# Altium schematic sheet Sheet1.SchDoc
size A3; SheetNumber: 3; SheetTotal: 3
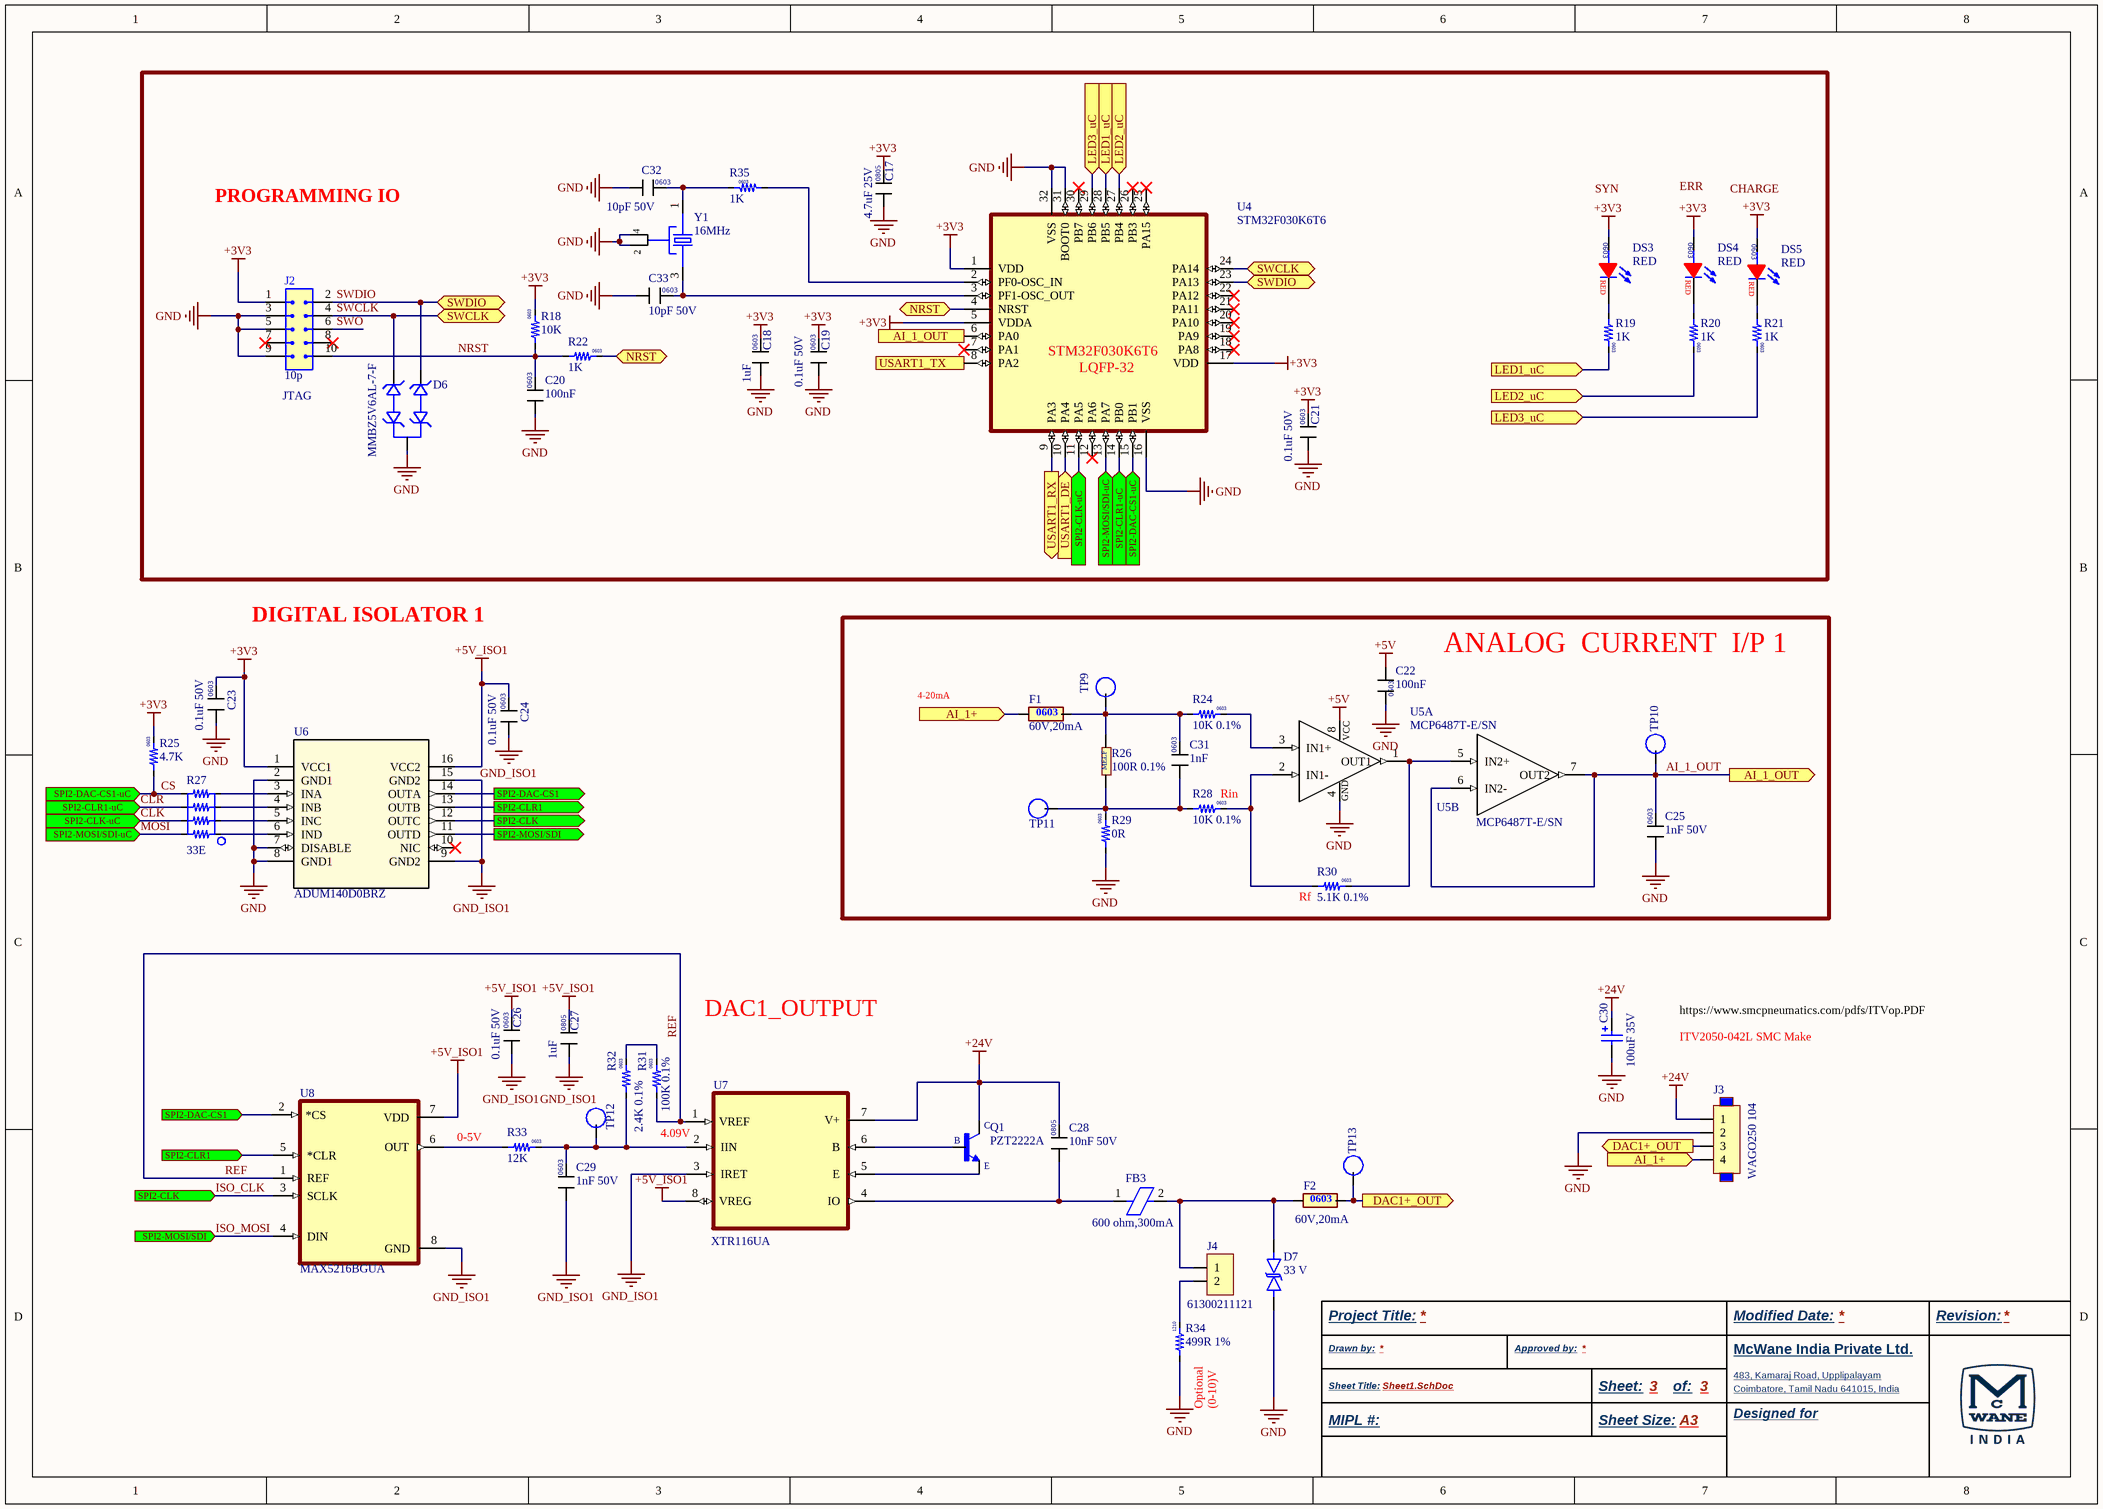
[diagram p0: Sheet1.SchDoc]

## Parts
C17  4.7uF 25V  [CAP_0805]
C18  1uF  [CAP_0603]
C19  0.1uF 50V  [CAP_0603]
C20  100nF  [CAP_0603]
C21  0.1uF 50V  [CAP_0603]
C22  100nF  [CAP_0603]
C23  0.1uF 50V  [CAP_0603]
C24  0.1uF 50V  [CAP_0603]
C25  1nF 50V  [CAP_0603]
C26  0.1uF 50V  [CAP_0603]
C27  1uF  [CAP_0805]
C28  10nF 50V  [CAP_0805]
C29  1nF 50V  [CAP_0603]
C30  100uF 35V  [CAP_ELE_AL_6.3X7.7]
C31  1nF  [CAP_0603]
C32  10pF 50V  [CAP_0603]
C33  10pF 50V  [CAP_0603]
D6  MMBZ5V6AL-7-F  [SOT23]
D7  33 V  [Diode_SMA_DO-214AC]
DS3  RED  [LED_0603]
DS4  RED  [LED_0603]
DS5  RED  [LED_0603]
F1  60V,20mA  [FUSE_0603]
F2  60V,20mA  [FUSE_0603]
FB3  600 ohm,300mA  [Ferrite_bead_0603]
J2  10p  [FTS-105-01-F-DV]
J3  WAGO250 104  [WAGO250_104]
J4  61300211121  [BERG_2_PIN_M_V_S_2.54mm]
Q1  PZT2222A  [SOT-223]
R18  10K  [RES_0603]
R19  1K  [RES_0603]
R20  1K  [RES_0603]
R21  1K  [RES_0603]
R22  1K  [RES_0603]
R24  10K 0.1%  [RES_0603]
R25  4.7K  [RES_0603]
R26  100R 0.1%  [RES_MELF]
R27  33E  [1206_8pin_Array_Resistor]
R28  10K 0.1%  [RES_0603]
R29  0R  [RES_0603]
R30  5.1K 0.1%  [RES_0603]
R31  100K 0.1%  [RES_0603]
R32  2.4K 0.1%  [RES_0603]
R33  12K  [RES_0603]
R34  499R 1%  [RES_1210]
R35  1K  [RES_0603]
TP9  TEST_POINT_SMD  [TEST_POINT_SMD]  (value not drawn)
TP10  TEST_POINT_SMD  [TEST_POINT_SMD]  (value not drawn)
TP11  TEST_POINT_SMD  [TEST_POINT_SMD]  (value not drawn)
TP12  TEST_POINT_SMD  [TEST_POINT_SMD]  (value not drawn)
TP13  TEST_POINT_SMD  [TEST_POINT_SMD]  (value not drawn)
U4  STM32F030K6T6  [LQFP32]
U5  MCP6487T-E/SN  [SOIC127P600X175-8N]  (parts A,B of 2)
U6  ADUM140D0BRZ  [SOIC127P600X175-16N]
U7  XTR116UA  [SOIC-8N]
U8  MAX5216BGUA  [SOP8P65_300X640X120L60X24N(TSSOP8)]
Y1  16MHz  [XTAL_3.2X2.5mm]

## Blocks framed on the sheet
PROGRAMMING IO: C17-C21 C32 C33 D6 DS3-DS5 J2 R18-R22 R35 U4 Y1
ANALOG  CURRENT  I/P 1: C22 C25 C31 F1 R24 R26 R28-R30 TP9-TP11 U5

## Ports
AI_1+ (in), AI_1_OUT (out), DAC1+_OUT (out), LED1_uC (in), LED2_uC (in), LED3_uC (in), NRST (bidir), SPI2-CLK (in), SPI2-CLK (out), SPI2-CLK-uC (in), SPI2-CLR1 (in), SPI2-CLR1 (out), SPI2-CLR1-uC (in), SPI2-DAC-CS1 (in), SPI2-DAC-CS1 (out), SPI2-DAC-CS1-uC (in), SPI2-MOSI/SDI (in), SPI2-MOSI/SDI (out), SPI2-MOSI/SDI-uC (in), SWCLK (bidir), SWDIO (bidir), USART1_DE (in), USART1_RX (out), USART1_TX (in)

## Nets
+3V3: C17.2 C18.2 C19.2 C21.2 C23.2 DS3.A DS4.A DS5.A J2.1 R18.2 R25.2 U4.1(VDD) U4.5(VDDA) U4.17(VDD) U6.1(VCC1)
+5V: C22.2 U5.8(VCC)
+5V_ISO1: C24.2 C26.2 C27.2 U6.16(VCC2) U7.8(VREG) U8.7(VDD)
+24V: C28.2 C30.2(P) J3.1 Q1.2(C) U7.7(V+)
GND: C17.1 C18.1 C19.1 C20.1 C21.1 C22.1 C23.1 C25.1 C30.1(N) C32.1 C33.1 D6.3(GND) D7.A J2.3 J2.5 J2.9 J3.2 R29.1 R34.1 U4.16(VSS) U4.31(BOOT0) U4.32(VSS) U5.4(GND) U6.2(GND1) U6.7(DISABLE) U6.8(GND1) Y1.2(GND) Y1.4(GND)
GND_ISO1: C24.1 C26.1 C27.1 C29.1 U6.9(GND2) U6.15(GND2) U7.3(IRET) U8.8(GND)
AI_1+: F1.1 J3.4 ; port AI_1+
AI_1_OUT: C25.2 TP10.1 U4.6(PA0) U5.6(IN2-) U5.7(OUT2) ; port AI_1_OUT
CLK: R27.7 U4.11(PA5) ; port SPI2-CLK-uC
CLR: R27.6 U4.14(PB0) ; port SPI2-CLR1-uC
CS: R25.1 R27.5 U4.15(PB1) ; port SPI2-DAC-CS1-uC
DAC1+_OUT: F2.2 J3.3 TP13.1 ; port DAC1+_OUT
ISO_CLK: U6.12(OUTC) U8.3(SCLK) ; port SPI2-CLK
ISO_MOSI: U6.11(OUTD) U8.4(DIN) ; port SPI2-MOSI/SDI
LED1_uC: R19.2 U4.28(PB5) ; port LED1_uC
LED2_uC: R20.2 U4.27(PB4) ; port LED2_uC
LED3_uC: R21.2 U4.29(PB6) ; port LED3_uC
MOSI: R27.8 U4.13(PA7) ; port SPI2-MOSI/SDI-uC
NRST: C20.2 J2.10 R18.1 R22.1
NRST: R22.2 U4.4(NRST) ; port NRST  [a separate net that carries the same name]
REF: R31.1 U7.1(VREF) U8.1(REF)
SPI2-CLR1: U6.13(OUTB) U8.5(*CLR) ; port SPI2-CLR1
SPI2-DAC-CS1: U6.14(OUTA) U8.2(*CS) ; port SPI2-DAC-CS1
SWCLK: D6.1(IO1) J2.4 U4.24(PA14) ; port SWCLK
SWDIO: D6.2(IO2) J2.2 U4.23(PA13) ; port SWDIO
SWO: J2.6
USART1_DE: U4.10(PA4) ; port USART1_DE
USART1_RX: U4.9(PA3) ; port USART1_RX
USART1_TX: U4.8(PA2) ; port USART1_TX
NetC28_1: C28.1 FB3.1 U7.4(IO)
NetC29_2: C29.2 R32.1 R33.2 TP12.1 U7.2(IIN)
NetC31_1: C31.1 R26.1 R28.1 R29.2 TP11.1
NetC31_2: C31.2 F1.2 R24.1 R26.2 TP9.1
NetC32_2: C32.2 R35.2 Y1.1
NetC33_2: C33.2 U4.3(PF1-OSC_OUT) Y1.3
NetD7_C: D7.C F2.1 FB3.2 J4.1
NetDS3_C: DS3.C R19.1
NetDS4_C: DS4.C R20.1
NetDS5_C: DS5.C R21.1
NetJ4_2: J4.2 R34.2
NetQ1_1: Q1.1(B) U7.6(B)
NetQ1_3: Q1.3(E) U7.5(E)
NetR24_2: R24.2 U5.3(IN1+)
NetR27_1: R27.1 U6.6(IND)
NetR27_2: R27.2 U6.5(INC)
NetR27_3: R27.3 U6.4(INB)
NetR27_4: R27.4 U6.3(INA)
NetR28_2: R28.2 R30.1 U5.2(IN1-)
NetR30_2: R30.2 U5.1(OUT1) U5.5(IN2+)
NetR31_2: R31.2 R32.2
NetR33_1: R33.1 U8.6(OUT)
NetR35_1: R35.1 U4.2(PF0-OSC_IN)

Not connected (* = marked no-connect by the designer): J2 7* 8*; U4 7(PA1)* 12(PA6)* 18(PA8)* 19(PA9)* 20(PA10)* 21(PA11)* 22(PA12)* 25(PA15)* 26(PB3)* 30(PB7)*; U6 10(NIC)*

## Notes on the sheet
- (near J2) JTAG
- DIGITAL ISOLATOR 1
- 4-20mA
- (near R28) Rin
- (near R30) Rf
- DAC1_OUTPUT
- ITV2050-042L SMC Make
- https://www.smcpneumatics.com/pdfs/ITVop.PDF
- 0-5V
- 4.09V
- (near R34) Optional
- (near R34) (0-10)V
- Labels drawn without touching a wire or pin: CHARGE, ERR, SYN
- Project Title:
- Modified Date:
- Revision:
- Drawn by:
- Sheet Title:
- Approved by:
- Sheet:
- of:
- McWane India Private Ltd.
- 483, Kamaraj Road, Upplipalayam
- Coimbatore, Tamil Nadu 641015, India
- MIPL #:
- Sheet Size:
- A3
- Designed for

## Library data of the parts
C17 = C0805-4.7uF 25V-MLCC: SMD Multilayer Ceramic Capacitor, 4.7 µF, 25 V, 0805 [2012 Metric], ± 10%, X7R, -55 °C; Manufacturer Part Number: CC0805KKX7R8BB475; Brand: YAGEO; Marking: 475; Suppplier: ELEMENT 14; Package: 0805; Component: Capacitor
C18 = C0603-1uF 50V-MLCC: SMD Multilayer Ceramic 1 µF ±10% 50V Ceramic Capacitor X7R 0603 (2012 Metric); Manufacturer Part Number: CC0603KRX7R9BB105; Brand: YAGEO; Marking: 105; Package: 0603; Supplier: ELEMENT 14; Component: Capacitor; LCSC Part: C559769
C19-C24 C26 = C0603-0.1uF 50V-MLCC: SMD Multilayer Ceramic Capacitor, 0.1 µF, 50 V, 0603 [1608 Metric], ± 10%, X7R; Manufacturer Part Number: CC0603KRX7R9BB104; Brand: YAGEO; Marking: 104; Package: 0603; Supplier: ELEMENT 14; Component: Capacitor
  C20 C22: LCSC Part: C14663
  C26: Supplier PN: C314282
C25 = C0603-1nF 50V-MLCC: SMD Multilayer Ceramic Capacitor, 1 nF, 50 V, 0603 [1608 Metric], ± 10%, X7R; Manufacturer Part Number: CC0603KRX7R9BB102; Brand: YAGEO; Marking: ELEMENT 14; Suplier PN: C100040; Package: 0603; Supplier: 102; Component: Capacitor
C27 = C0805-1uF 50V-MLCC: SMD Multilayer Ceramic Capacitor, 1 µF, 50 V, 0805 [2012 Metric], ± 10%, X7R, -55 °C; Manufacturer Part Number: CC0805KKX7R9BB105; Brand: YAGEO; Marking: 105; Package: 0805; Component: Capacitor; LCSC Part: C91185
C28 = C0805-10nF 50V-MLCC: SMD Multilayer Ceramic Capacitor, 10nF, 50 V, 0805 [2012 Metric], ± 10%, X7R; Manufacturer Part Number: CC0805KRX7R9BB103; Brand: YAGEO; Marking: 103; Package: 0805; Supplier: ELEMENT 14; Component: Capacitor
C29 C31 = C0603-1nF 50V-MLCC: SMD Multilayer Ceramic Capacitor, 1 nF, 50 V, 0603 [1608 Metric], ± 10%, X7R; Manufacturer Part Number: CC0603KRX7R9BB102; Brand: YAGEO; Marking: ELEMENT 14; Package: 0603; Supplier: 102; Component: Capacitor
C30 = CAP_SMD_100uF_35V: SMD Aluminium Electrolytic Capacitor, Radial Can - SMD, 100 µF, 35 V, 2000 hours @ 105°C, Polar; Manufacturer Part Number: MCVVT035M101EA6L; Brand: MULTICOMP PRO; Package: 6.3X7.7mm; Marking: *; Supplier: Element 14; Component: Capacitor
C32 C33 = C0603-10pF 50V-MLCC: SMD Multilayer Ceramic Capacitor, 10 pF, 50 V, 0603 [1608 Metric], ± 10%, C0G / NP0, -55 °C; Manufacturer Part Number: CC0603KRNPO9BN100; Brand: YAGEO; Marking: 100; Package: 0603; Supplier: ELEMENT 14; Component: Capacitor
D6 = MMBZ5V6AL-7-F: ESD Suppressors / TVS Diodes 5.6V 225mW; Brand: Diodes Incorporated; Package: SOT-23-3; Manufacturer Part Number: MMBZ5V6AL-7-F; Marking: *; LCSC Part: C531167
D7 = SMAJ33CAHE3_A/H_1: TVS Diode, TRANSZORB SMAJ, Bidirectional, 33 V, 53.3 V, DO-214AC (SMA), 2 Pins; Brand: Vishay General Semiconductor; Package: DO-214AC-2; Manufacturer Part Number: SMAJ33CAHE3_A/H; Supplier: *; Marking: *
DS3-DS5 = 19-217/R6C-AL1M2VY/3T: Red LED Indication - Discrete 1.95V 0603 (1608 Metric); Brand: Everlight Elec; Package: 0603; Manufacturer Part Number: 19-217/R6C-AL1M2VY/3T; LCSC Part: C72044
F1 F2 = 0ZCM0002FF2G: Polymeric PTC Resettable Fuse 60V 20 mA Ih Surface Mount 0603 (1608 Metric); Brand: Bel Fuse; Manufacturer Part Number: 0ZCM0002FF2G; Package: 0603
FB3 = Ferrite_0603: Ferrite Beads 600ohms 100MHz 300mA Monolithic 0603 SMD; Manufacturer Part Number: HZ0603C601R-10; Brand: Laird; Supplier: Mouser Electronics; Marking: *; Package: 0603
J2 = FTS-105-01-F-DV: Connector Header Surface Mount 10 position 0.050" (1.27mm); Brand: Samtec Inc.; Value: 5X2 POS, 1.27mmP; Manufacturer Part Number: FTS-105-01-F-DV; Datasheet Web: http://suddendocs.samtec.com/catalog_english/fts.pdf; Datasheet Local: *; DNP: *; MIPL Status: *; MIPL Id: *; Operating Temperature: -55°C ~ 125°C; Package: SMD; Type: Header - Male; Voltage rating: *; LCSC Part: C3348793
J3 = WAGO250_104: 4 Position Wire to Board Terminal Block 45° (135°) Angle with Board 0.138" (3.50mm) Through Hole; Manufacturer Part Number: 250-104/000-012; Brand: WAGO Corporation; Marking: *; Supplier: *; Package: 3.5mm
J4 = BERG_2_PIN_M_V_S_2.54mm: Pin Header, Vertical, Board-to-Board, 2.54 mm, 1 Rows, 2 Contacts, Through Hole Straight, WR-PHD; Brand: Würth Elektronik; Manufacturer Part Number: 61300211121; Package: 2.54mm
Q1 = PZT2222A: Bipolar _BJT_ Transistor NPN 40V 1A 300MHz 1W Surface Mount; Brand: ON Semiconductor; Manufacturer Part Number: PZT2222A; Package: SOT-223-4; SnapEDA_Link: https://www.snapeda.com/parts/PZT2222A/ON%20Semiconductor/view-part/1171857/?ref=snap; Availability: Unavailable; Price: None; Value: *
R18 = R0603-10K-1%: SMD Chip Resistor, 10 kohm, ± 1%, 100 mW, 0603 [1608 Metric], Thick Film, General Purpose; Manufacturer Part Number: RC0603FR-0710KL; Brand: YAGEO; Marking: 1002; Package: 0603; Supplier: ELEMENT 14; Component: Resistor; LCSC Part: C98220
R19-R22 R35 = R0603-1K-1%: SMD Chip Resistor, 1 kohm, ± 1%, 100 mW, 0603 [1608 Metric], Thick Film, General Purpose; Manufacturer Part Number: RC0603FR-071KL; Brand: YAGEO; Marking: 1001; Package: 0603; Supplier: ELEMENT 14; Component: Resistor; LCSC Part: C109318
R24 R28 = R0603-10K-0.1%: SMD Chip Resistor, 10 kohm, ± 0.1%, 100 mW, 0603 [1608 Metric], Thick Film, General Purpose; Manufacturer Part Number: RT0603BRD0710KL; Brand: YAGEO; Marking: 1002; Package: 0603; Component: Resistor; Supplier: ELEMENT 14; LCSC Part: C95204
R25 = R0603-4.7K-1%: SMD Chip Resistor, 4.7 kohm, ± 1%, 100 mW, 0603 [1608 Metric], Thick Film, General Purpose; Manufacturer Part Number: RC0603FR-074K7L.; Brand: YAGEO; Marking: 4701; Supplier: ELEMENT 14; Package: 0603; Component: Resistor
R26 = MCFRBTNV1000: Surface Mount MELF Resistor, 100 ohm, MCF, 200 V, Metal Film, 250 mW, ± 0.1%; Brand: MULTICOMP PRO; Manufacturer Part Number: MCFRBTNV1000; Package: MELF; Component: Resistor
R27 = R1206-33E-1%-ARRAY: 4 8 ±5% 33Ω 62.5mW ±200ppm/℃ 0603x4 Resistor Networks & Arrays ROHS; Manufacturer Part Number: YC164-JR-0733RL; Brand: YAGEO; Package: 0603x4; Component: Resistor; LCSC Part: C165956
R29 = R0603-0E-1%: 0 Ohms Jumper 0.1W, 1/10W Chip Resistor 0603 (1608 Metric) Moisture Resistant Thick Film; Manufacturer Part Number: RC0603JR-070RL; Brand: YAGEO; Marking: 000; Package: 0603; Supplier: ELEMENT 14; Component: Resistor
R30 = R0603-5.1K-0.1%: SMD Chip Resistor, 5.1 kohm, ± 0.1%, 100 mW, 0603 [1608 Metric], Thick Film, General Purpose; Manufacturer Part Number: RT0603BRD075K1L; Brand: YAGEO; Marking: 5101; Supplier: ELEMENT 14; Package: 0603; Component: Resistor; LCSC Part: C122969
R31 = R0603-100K-0.1%: SMD Chip Resistor, 100 kohm, ± 0.1%, 100 mW, 0603 [1608 Metric], Thick Film, General Purpose; Manufacturer Part Number: RT0603BRD07100KL; Brand: YAGEO; Marking: 1003; Package: 0603; Supplier: ELEMENT 14; Component: Resistor; LCSC Part: C122538
R32 = R0603-2K4-0.1%: SMD Chip Resistor, 2.4 kohm, ± 0.1%, 100 mW, 0603 [1608 Metric], Thick Film, General Purpose; Manufacturer Part Number: RT0603BRD072K4L; Brand: YAGEO; Package: 0603; Supplier: ELEMENT 14; Component: Resistor; LCSC Part: C861300
R33 = R0603-12K-1%: SMD Chip Resistor, 12 kohm, ± 1%, 100 mW, 0603 [1608 Metric], Thick Film, General Purpose; Manufacturer Part Number: RC0603FR-0712KL; Brand: YAGEO; Marking: 1202; Supplier: ELEMENT 14; Package: 0603; Component: Resistor; LCSC Part: C114659
R34 = R1210-499R-1%: 0.5W Thick Film Resistors ±100ppm/℃ ±1% 499Ω 1210 Chip Resistor - Surface Mount ROHS; Manufacturer Part Number: RC1210FR-07499RL; Brand: YAGEO; Package: 1210; Component: Resistor; LCSC Part: RC1210FR-07499RL; Supplier: ELEMENT 14
U4 = STM32F030K6T6: ARM® Cortex®-M0 STM32F0 Microcontroller IC 32-Bit Single-Core 48MHz 32KB (32K x 8) FLASH 32-LQFP (7x7); Brand: STMICROELECTRONICS; Manufacturer Part Number: STM32F030K6T6; Package: LQFP-32
U5 = MCP6487T-E/SN: General Purpose Amplifier 2 Circuit Rail-to-Rail 8-SOIC; Brand: Microchip Technology; Manufacturer Part Number: MCP6487T-E/SN; Package: SOIC8; Marking: *; Supplier: *
U6 = ADUM140D0BRZ: Digital Isolator, 4 Channels, 1.7 V, 5.5 V, NSOIC, 16 Pins, 150 Mbps; Brand: AD; Manufacturer Part Number: ADUM140D0BRZ; Package: SOIC-16
U7 = XTR116UA: Signal Conditioner, 4-20mA Signal Conditioner, 380 kHz, 7.5 V, 36 V, 8 Pins; Brand: Texas Instruments; Manufacturer Part Number: XTR116UA; Package: SOIC-8; Value: *; SnapEDA_Link: https://www.snapeda.com/parts/XTR115U/Texas%20Instruments/view-part/1101104/?ref=snap; Price: None; Mouser-Purchase-URL: https://snapeda.com/shop?store=Mouser&id=1101104; DigiKey-Purchase-URL: https://snapeda.com/shop?store=DigiKey&id=1101104; Texas_Instruments-Purchase-URL: https://snapeda.com/shop?store=Texas+Instruments&id=1101104; Availability: Warning
U8 = MAX5216BGUA: IC DAC 16BIT V-OUT 8UMAX; Brand: Maxim Integrated; Manufacturer Part Number: MAX5216BGUA; Purchase-URL: https://pricing.snapeda.com/search/part/MAX5216BGUA/?ref=eda; Package: 8UMAX; Availability: In Stock; Value: *; SnapEDA_Link: https://www.snapeda.com/parts/MAX5216BGUA/Maxim+Integrated/view-part/?ref=snap; Price: None; Check_prices: https://www.snapeda.com/parts/MAX5216BGUA/Maxim+Integrated/view-part/?ref=eda
Y1 = X322516MOB4SI: 16MHz SMD Crystal Resonator 12pF ±10ppm ±30ppm -40℃~+85℃ SMD3225-4P Crystals ROHS; Brand: YXC; Manufacturer Part Number: X322516MOB4SI; Package: SMD 3.2X2.5mm-4P; Marking: *; LCSC Part: C12668